# Altium project Graviton.PrjPcb (part 3 of 3)

## Sheet adc-power.SchDoc: ADC - Power
size Letter; CheckedBy: J. Brinton; CompanyName: Signal Laboratories, Inc.; DrawnBy: J. Brinton; Engineer: J. Brinton; Address1: 3479 Edison Way; Address2: Menlo Park CA 94025; Address3: +1 (877) 778-8435; Address4: siglabs.com; Revision: 3; SheetNumber: 22; SheetTotal: 49
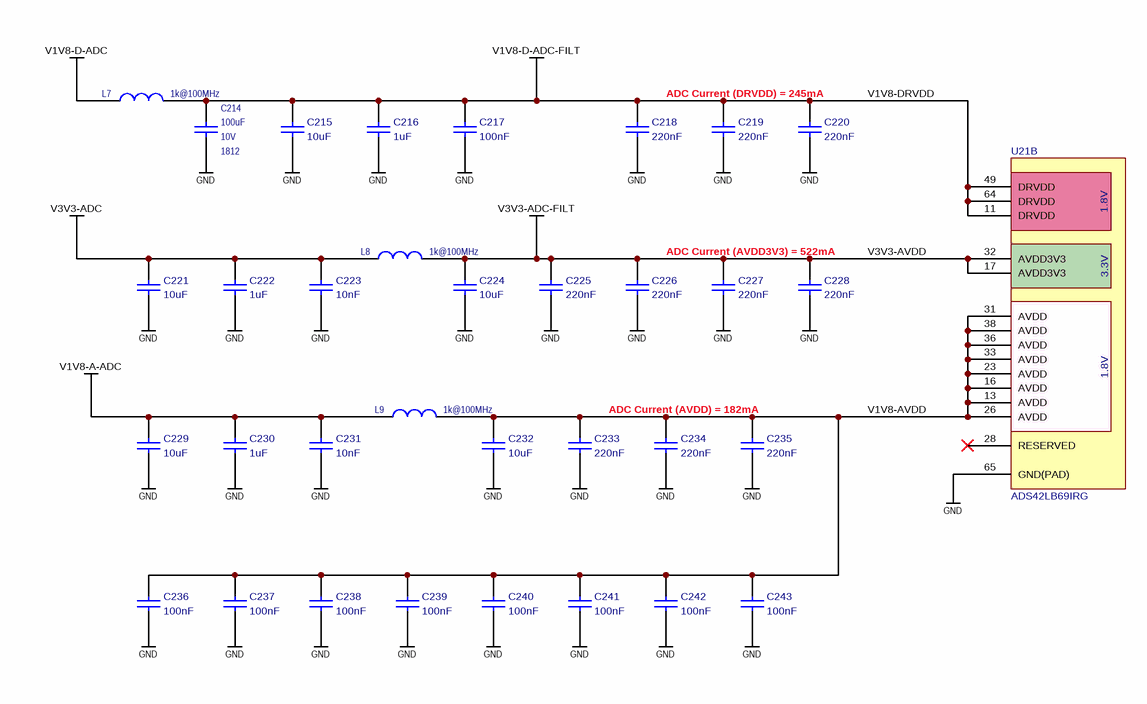
[diagram p16: adc-power.SchDoc]

### Parts
C214  value 100uF  Voltage: 10V  Package: 1812  [CAPC450X320X360L20N]  (hidden comment: C4532X5R1A107M280KC)
C215  value 10uF  [CAPC200X125X145L45N]  (hidden comment: CL21B106KOQNNNE)
C216  value 1uF  [CAPC200X125X145L45N]  (hidden comment: TMK212B7105KG)
C217  value 100nF  [CAPC100X50X55L25N]  (hidden comment: CC0402KRX7R8BB104)
C218  value 220nF  [CAPC100X50X55L25N]  (hidden comment: C1005X7R1E224K050BE)
C219  value 220nF  [CAPC100X50X55L25N]  (hidden comment: C1005X7R1E224K050BE)
C220  value 220nF  [CAPC100X50X55L25N]  (hidden comment: C1005X7R1E224K050BE)
C221  value 10uF  [CAPC200X125X145L45N]  (hidden comment: CL21B106KOQNNNE)
C222  value 1uF  [CAPC200X125X145L45N]  (hidden comment: TMK212B7105KG)
C223  value 10nF  [CAPC100X50X55L25N]  (hidden comment: GRM155R71H103KA88)
C224  value 10uF  [CAPC200X125X145L45N]  (hidden comment: CL21B106KOQNNNE)
C225  value 220nF  [CAPC100X50X55L25N]  (hidden comment: C1005X7R1E224K050BE)
C226  value 220nF  [CAPC100X50X55L25N]  (hidden comment: C1005X7R1E224K050BE)
C227  value 220nF  [CAPC100X50X55L25N]  (hidden comment: C1005X7R1E224K050BE)
C228  value 220nF  [CAPC100X50X55L25N]  (hidden comment: C1005X7R1E224K050BE)
C229  value 10uF  [CAPC200X125X145L45N]  (hidden comment: CL21B106KOQNNNE)
C230  value 1uF  [CAPC200X125X145L45N]  (hidden comment: TMK212B7105KG)
C231  value 10nF  [CAPC100X50X55L25N]  (hidden comment: GRM155R71H103KA88)
C232  value 10uF  [CAPC200X125X145L45N]  (hidden comment: CL21B106KOQNNNE)
C233  value 220nF  [CAPC100X50X55L25N]  (hidden comment: C1005X7R1E224K050BE)
C234  value 220nF  [CAPC100X50X55L25N]  (hidden comment: C1005X7R1E224K050BE)
C235  value 220nF  [CAPC100X50X55L25N]  (hidden comment: C1005X7R1E224K050BE)
C236  value 100nF  [CAPC100X50X55L25N]  (hidden comment: CC0402KRX7R8BB104)
C237  value 100nF  [CAPC100X50X55L25N]  (hidden comment: CC0402KRX7R8BB104)
C238  value 100nF  [CAPC100X50X55L25N]  (hidden comment: CC0402KRX7R8BB104)
C239  value 100nF  [CAPC100X50X55L25N]  (hidden comment: CC0402KRX7R8BB104)
C240  value 100nF  [CAPC100X50X55L25N]  (hidden comment: CC0402KRX7R8BB104)
C241  value 100nF  [CAPC100X50X55L25N]  (hidden comment: CC0402KRX7R8BB104)
C242  value 100nF  [CAPC100X50X55L25N]  (hidden comment: CC0402KRX7R8BB104)
C243  value 100nF  [CAPC100X50X55L25N]  (hidden comment: CC0402KRX7R8BB104)
L7  value 1k@100MHz  [1806]  (hidden comment: BLM41PG102SN1L)
L8  value 1k@100MHz  [1806]  (hidden comment: BLM41PG102SN1L)
L9  value 1k@100MHz  [1806]  (hidden comment: BLM41PG102SN1L)
U21  ADS42LB69IRG  [S-PVQFN-N64]  (part B of 4)

### Nets
GND: C214.1 C215.2 C216.2 C217.2 C218.2 C219.2 C220.2 C221.2 C222.2 C223.2 C224.2 C225.2 C226.2 C227.2 C228.2 C229.2 C230.2 C231.2 C232.2 C233.2 C234.2 C235.2 C236.2 C237.2 C238.2 C239.2 C240.2 C241.2 C242.2 C243.2 U21.65(GND(PAD))
V1V8-A-ADC: C229.1 C230.1 C231.1 L9.1
V1V8-D-ADC: L7.1
V1V8-D-ADC-FILT: C214.2 C215.1 C216.1 C217.1 C218.1 C219.1 C220.1 L7.2 U21.11(DRVDD) U21.49(DRVDD) U21.64(DRVDD)  [also labelled V1V8-DRVDD]
V3V3-ADC: C221.1 C222.1 C223.1 L8.1
V3V3-ADC-FILT: C224.1 C225.1 C226.1 C227.1 C228.1 L8.2 U21.17(AVDD3V3) U21.32(AVDD3V3)  [also labelled V3V3-AVDD]
V1V8-AVDD: C232.1 C233.1 C234.1 C235.1 C236.1 C237.1 C238.1 C239.1 C240.1 C241.1 C242.1 C243.1 L9.2 U21.13(AVDD) U21.16(AVDD) U21.23(AVDD) U21.26(AVDD) U21.31(AVDD) U21.33(AVDD) U21.36(AVDD) U21.38(AVDD)  [project net V1V8-AVDD_22]

Not connected (* = marked no-connect by the designer): U21 28(RESERVED)*

### Notes on the sheet
- ADC Current (DRVDD) = 245mA
- ADC Current (AVDD3V3) = 522mA
- ADC Current (AVDD) = 182mA
- Title
- Engineer
- Revision
- Drawn By
- Checked By
- Date
- Sheet
- of
- (in symbol ADS42LB69IRG, part B) 1.8V; 3.3V

### Library data of the parts
C214 = CAP 0603: Ceramic Capacitor 100uF ±20% 10V X5R 1812; Manufacturer: TDK; Tr: -55:85; Manufacturer P/N: C4532X5R1A107M280KC; Tolerance: ±20%
C215 C221 C224 C229 C232 = LMK212B7106KG: Ceramic Capacitor 10uF ±10% 16V X7R 0805; Manufacturer: Samsung; Tr: -55:105; Manufacturer P/N: CL21B106KOQNNNE; Tolerance: ±10%; Package: 0805; Voltage: 16V
C216 C222 C230 = TMK212B7105KG: Ceramic Capacitor 1uF ±10% 25V X7R 0805; Manufacturer: Taiyo Yuden; Manufacturer P/N: TMK212B7105KG; Tolerance: ±10%; Tr: *; Package: 0805; Voltage: 25V
C217 C236-C243 = TMK105B7104KV: Ceramic Capacitor 100nF ±10% 25V X7R 0402; Manufacturer: Yageo; Tolerance: ±10%; Tr: *; Package: 0402; Voltage: 25V
  C217: Manufacturer P/N: CC0402KRX7R8BB104
  C236-C243: Manufacturer P/N: TMK105B7104KV
C218-C220 C225-C228 C233-C235 = TMK105B7224KV: Ceramic Capacitor 220nF ±10% 25V X7R 0402; Manufacturer: TDK; Manufacturer P/N: C1005X7R1E224K050BE; Tolerance: ±10%; Tr: *; Package: 0402; Voltage: 25V
C223 C231 = TMK105B7103KV: Ceramic Capacitor 10nF ±10% 50V X7R 0402; Manufacturer: Murata; Tr: -55:125; Manufacturer P/N: GRM155R71H103KA88; Tolerance: ±10%; Package: 0402
L7-L9 = INDUCTANCE1: Ferrite Bead 1k@100MHz 1.5A 1806; Manufacturer: Murata; Tr: -55:125; Manufacturer P/N: BLM41PG102SN1L; Package: 1806
U21 = ADS42LB69IRG: Dual-Channel, 16-Bit, 250-MSPS Analog-to-Digital Converter; Manufacturer: Texas Instruments; Manufacturer P/N: ADS42LB69IRG

## Sheet adc-analog.SchDoc: ADC - Analog
size Letter; CheckedBy: J. Brinton; CompanyName: Signal Laboratories, Inc.; DrawnBy: J. Brinton; Engineer: J. Brinton; Address1: 3479 Edison Way; Address2: Menlo Park CA 94025; Address3: +1 (877) 778-8435; Address4: siglabs.com; Revision: 3; SheetNumber: 21; SheetTotal: 49; ModifiedDate: 4/20/2018
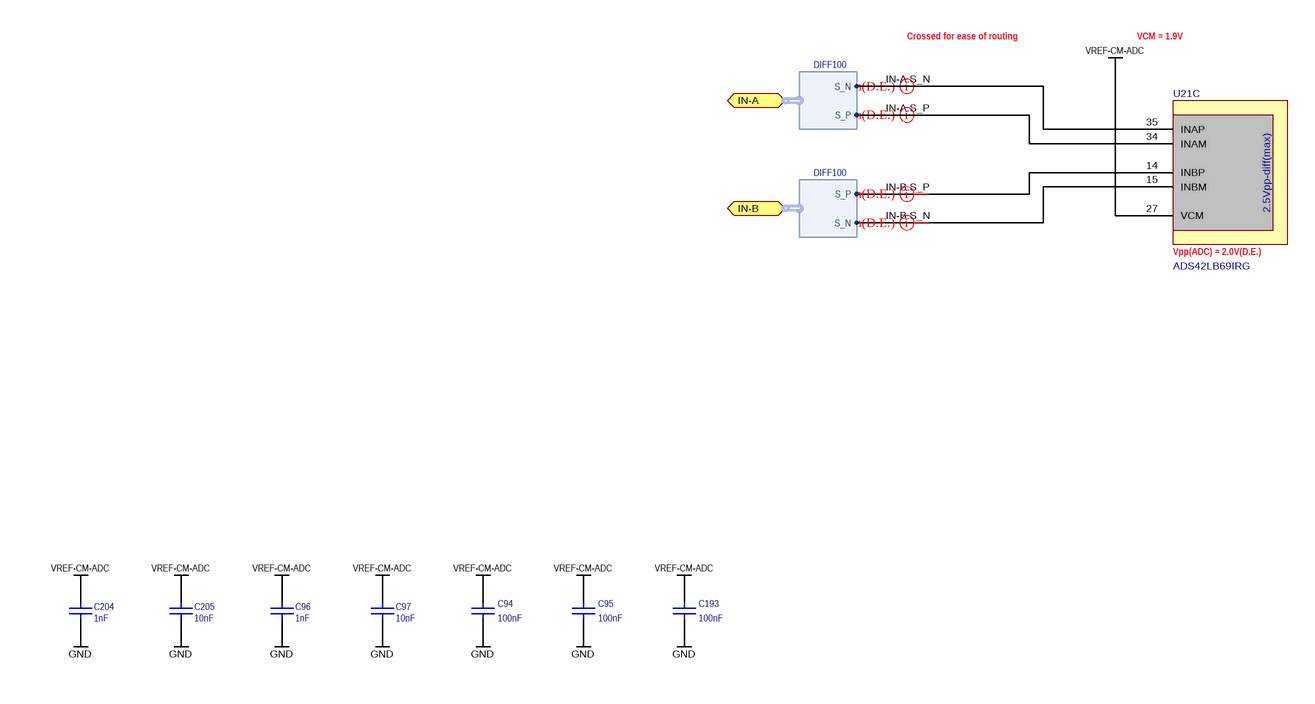
[diagram p17: adc-analog.SchDoc]

### Parts
C94  value 100nF  [CAPC100X50X55L25N]  (hidden comment: GRM155R71C104KA88J)
C95  value 100nF  [CAPC100X50X55L25N]  (hidden comment: GRM155R71C104KA88J)
C96  value 1nF  [CAPC100X50X55L25N]  (hidden comment: CGA2B2NP01H102J050BA)
C97  value 10nF  [CAPC100X50X55L25N]  (hidden comment: GRM155R71H103KA88)
C193  value 100nF  [CAPC100X50X55L25N]  (hidden comment: GRM155R71C104KA88J)
C204  value 1nF  [CAPC100X50X55L25N]  (hidden comment: CGA2B2NP01H102J050BA)
C205  value 10nF  [CAPC100X50X55L25N]  (hidden comment: GRM155R71H103KA88)
U21  ADS42LB69IRG  [S-PVQFN-N64]  (part C of 4)

### Ports
IN-A (harness DIFF100), IN-B (harness DIFF100)

### Harnesses
DIFF100: S_P, S_N

### Nets
GND: C94.2 C95.2 C96.1 C97.1 C193.2 C204.1 C205.1
VREF-CM-ADC: C94.1 C95.1 C96.2 C97.2 C193.1 C204.2 C205.2 U21.27(VCM)
IN-A.S_N: U21.35(INAP) ; port IN-A.S_N
IN-A.S_P: U21.34(INAM) ; port IN-A.S_P
IN-B.S_N: U21.15(INBM) ; port IN-B.S_N
IN-B.S_P: U21.14(INBP) ; port IN-B.S_P

### Layout directives
differential pair; net class z100diff12; Name: 100-Ohm(D.E.): IN-A.S_N, IN-A.S_P, IN-B.S_N, IN-B.S_P

### Notes on the sheet
- Crossed for ease of routing
- VCM = 1.9V
- (near U21) Vpp(ADC) = 2.0V(D.E.)
- Title
- Engineer
- Revision
- Drawn By
- Checked By
- Date
- Sheet
- of
- (in symbol ADS42LB69IRG, part C) 2.5Vpp-diff(max)

### Library data of the parts
C94 C95 C193 = CAP 0402: as C102 on sheet dac-analog; Voltage: 16V; Manufacturer P/N: GRM155R71C104KA88J; Package: 0402; Tolerance: ±10%
C96 C204 = CAP 0402: as C86 on sheet dac-digital; Voltage: 50V; Manufacturer P/N: CGA2B2NP01H102J050BA; Package: 0402; Tolerance: ±5%
C97 C205 = CAP 0402: as C290 on sheet dac-power; Voltage: 50V; Manufacturer P/N: GRM155R71H103KA88; Package: 0402; Tolerance: ±10%
U21 = ADS42LB69IRG: as U21 on sheet adc-power; Manufacturer P/N: ADS42LB69IRG

## Sheet adc-ldo.SchDoc: ADC - LDOs
size Letter; CheckedBy: J. Brinton; CompanyName: Signal Laboratories, Inc.; DrawnBy: J. Brinton; Engineer: J. Brinton; Address1: 3479 Edison Way; Address2: Menlo Park CA 94025; Address3: +1 (877) 778-8435; Address4: siglabs.com; Revision: 3; SheetNumber: 23; SheetTotal: 49
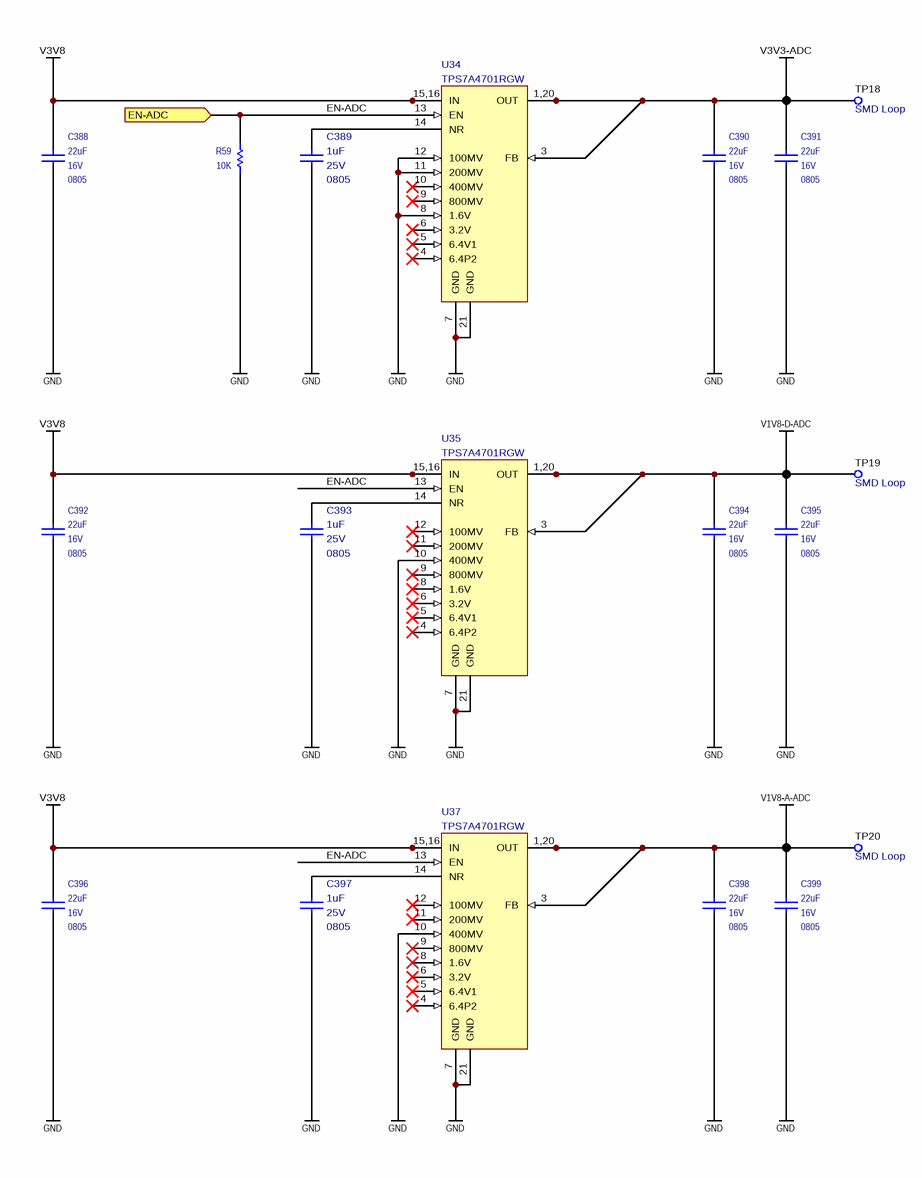
[diagram p18: adc-ldo.SchDoc]

### Parts
C388  value 22uF  Voltage: 16V  Package: 0805  [CAPC200X125X145L45N]  (hidden comment: CL21A226KOQNNNE)
C389  value 1uF  Package: 0805  Voltage: 25V  [CAPC200X125X145L45N]  (hidden comment: TMK212B7105KG)
C390  value 22uF  Voltage: 16V  Package: 0805  [CAPC200X125X145L45N]  (hidden comment: CL21A226KOQNNNE)
C391  value 22uF  Voltage: 16V  Package: 0805  [CAPC200X125X145L45N]  (hidden comment: CL21A226KOQNNNE)
C392  value 22uF  Voltage: 16V  Package: 0805  [CAPC200X125X145L45N]  (hidden comment: CL21A226KOQNNNE)
C393  value 1uF  Package: 0805  Voltage: 25V  [CAPC200X125X145L45N]  (hidden comment: TMK212B7105KG)
C394  value 22uF  Voltage: 16V  Package: 0805  [CAPC200X125X145L45N]  (hidden comment: CL21A226KOQNNNE)
C395  value 22uF  Voltage: 16V  Package: 0805  [CAPC200X125X145L45N]  (hidden comment: CL21A226KOQNNNE)
C396  value 22uF  Voltage: 16V  Package: 0805  [CAPC200X125X145L45N]  (hidden comment: CL21A226KOQNNNE)
C397  value 1uF  Package: 0805  Voltage: 25V  [CAPC200X125X145L45N]  (hidden comment: TMK212B7105KG)
C398  value 22uF  Voltage: 16V  Package: 0805  [CAPC200X125X145L45N]  (hidden comment: CL21A226KOQNNNE)
C399  value 22uF  Voltage: 16V  Package: 0805  [CAPC200X125X145L45N]  (hidden comment: CL21A226KOQNNNE)
R59  value 10K  [RESC1005X40N]  (hidden comment: ERJ-2RKF1002X)
TP18  Notes: SMD Loop  [5015]  (hidden comment: 5015)
TP19  Notes: SMD Loop  [5015]  (hidden comment: 5015)
TP20  Notes: SMD Loop  [5015]  (hidden comment: 5015)
U34  TPS7A4701RGW  [QFN65P500X500X100-21N]
U35  TPS7A4701RGW  [QFN65P500X500X100-21N]
U37  TPS7A4701RGW  [QFN65P500X500X100-21N]

### Ports
EN-ADC (in)

### Nets
GND: C388.1 C389.2 C390.1 C391.1 C392.1 C393.2 C394.1 C395.1 C396.1 C397.2 C398.1 C399.1 R59.2 U34.7(GND) U34.8(1.6V) U34.11(200MV) U34.12(100MV) U34.21(GND) U35.7(GND) U35.10(400MV) U35.21(GND) U37.7(GND) U37.10(400MV) U37.21(GND)
V1V8-A-ADC: C398.2 C399.2 TP20.1 U37.1(OUT) U37.3(FB) U37.20(OUT)
V1V8-D-ADC: C394.2 C395.2 TP19.1 U35.1(OUT) U35.3(FB) U35.20(OUT)
V3V3-ADC: C390.2 C391.2 TP18.1 U34.1(OUT) U34.3(FB) U34.20(OUT)
V3V8: C388.2 C392.2 C396.2 U34.15(IN) U34.16(IN) U35.15(IN) U35.16(IN) U37.15(IN) U37.16(IN)
EN-ADC: R59.1 U34.13(EN) U35.13(EN) U37.13(EN) ; port EN-ADC
NetC389_1: C389.1 U34.14(NR)
NetC393_1: C393.1 U35.14(NR)
NetC397_1: C397.1 U37.14(NR)

Not connected (* = marked no-connect by the designer): U34 4(6.4P2)* 5(6.4V1)* 6(3.2V)* 9(800MV)* 10(400MV)*; U35 4(6.4P2)* 5(6.4V1)* 6(3.2V)* 8(1.6V)* 9(800MV)* 11(200MV)* 12(100MV)*; U37 4(6.4P2)* 5(6.4V1)* 6(3.2V)* 8(1.6V)* 9(800MV)* 11(200MV)* 12(100MV)*

### Notes on the sheet
- Title
- Engineer
- Revision
- Drawn By
- Checked By
- Date
- Sheet
- of
- (in symbol TPS7A4701RGW_1) 15,16; 1,20

### Library data of the parts
C388 C390-C392 C394-C396 C398 C399 = CAP 0603: Ceramic Capacitor 22uF ±10% 16V X5R 0805; Manufacturer: Samsung; Tr: -55:85; Manufacturer P/N: CL21A226KOQNNNE; Tolerance: ±10%
C389 C393 C397 = TMK212B7105KG: as C216 on sheet adc-power; Manufacturer P/N: TMK212B7105KG; Tolerance: ±10%; Tr: *
R59 = RES 0402: as R62 on sheet dac-ldo; Package: 0402; Manufacturer P/N: ERJ-2RKF1002X; Tolerance: ±1%
TP18-TP20 = TEST_POINT_SMD_50: Test Point SMD; Manufacturer: Keystone; Manufacturer P/N: 5015
U34 U35 U37 = TPS7A4701RGW_1: Low-Dropout Linear Regulator 20-VQFN; Manufacturer: Texas Instruments; Manufacturer P/N: TPS7A4701RGW; Package: VQFN-20

## Sheet fans.SchDoc: Fan
size Letter; CheckedBy: J. Brinton; CompanyName: Signal Laboratories, Inc.; DrawnBy: J. Brinton; Engineer: J. Brinton; Address1: 3479 Edison Way; Address2: Menlo Park CA 94025; Address3: +1 (877) 778-8435; Address4: siglabs.com; Revision: 3; SheetNumber: 40; SheetTotal: 49
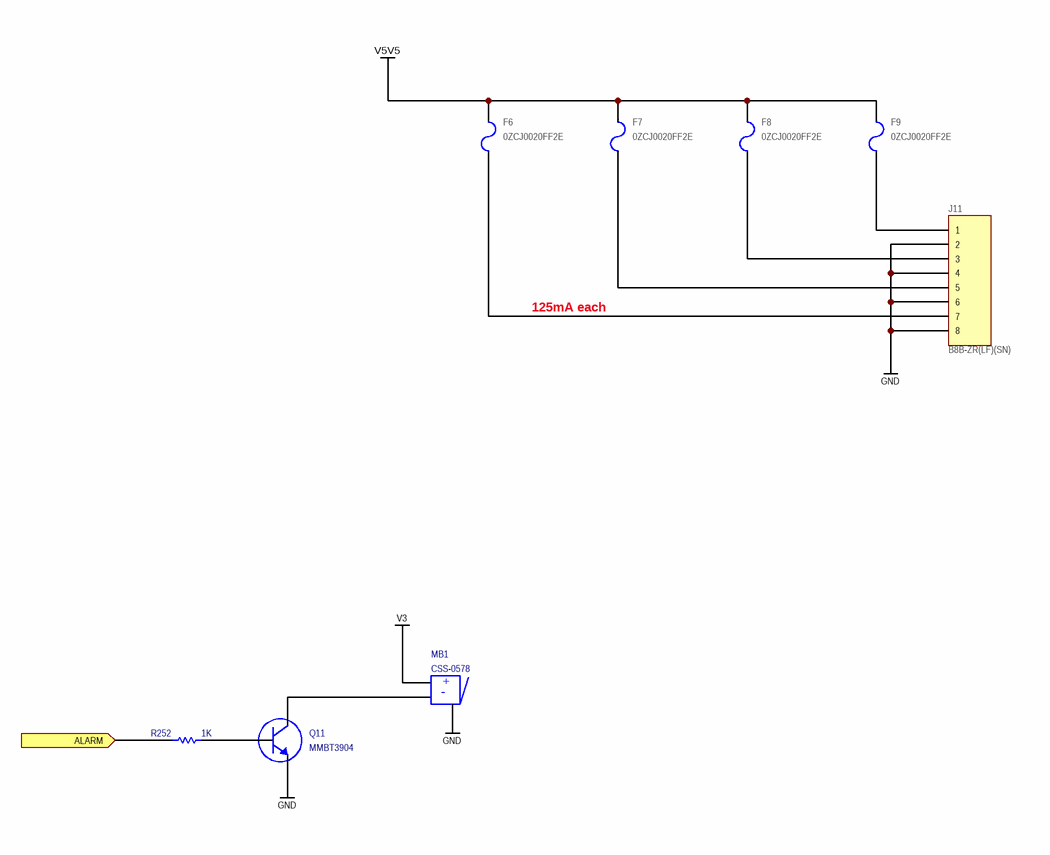
[diagram p19: fans.SchDoc]

### Parts
F6  0ZCJ0020FF2E  [1206]
F7  0ZCJ0020FF2E  [1206]
F8  0ZCJ0020FF2E  [1206]
F9  0ZCJ0020FF2E  [1206]
J11  B8B-ZR(LF)(SN)  [B8B-ZR]
MB1  CSS-0578  [CSS-0578]
Q11  MMBT3904  [SOT23]
R252  value 1K  [RESC1005X40N]  (hidden comment: RC0402FR-071KL)

### Ports
ALARM (in)

### Nets
GND: J11.2 J11.4 J11.6 J11.8 MB1.3(TAB) Q11.2(E)
V3: MB1.1(POS)
V5V5: F6.1 F7.1 F8.1 F9.1
NetF6_2: F6.2 J11.7
NetF7_2: F7.2 J11.5
NetF8_2: F8.2 J11.3
NetF9_2: F9.2 J11.1
NetMB1_2: MB1.2(NEG) Q11.3(C)
NetQ11_1: Q11.1(B) R252.1
NetR252_2: R252.2 ; port ALARM

### Notes on the sheet
- 125mA each
- Title
- Engineer
- Revision
- Drawn By
- Checked By
- Date
- Sheet
- of
- (in symbol CSS-0578) +; -

### Library data of the parts
F6-F9 = 0ZCJ0020FF2E: PTC Resettable Fuse, 0.2A, 30V, SMD 1206; Manufacturer: Bell Fuse; Manufacturer P/N: 0ZCJ0020FF2E; Package: 1206
J11 = Header 8: Through-hole Shrouded Header 8-Position; Manufacturer: JST; Manufacturer P/N: B8B-ZR(LF)(SN)
MB1 = CSS-0578: Magnetic Buzzer; Manufacturer: CUI, Inc.; Manufacturer P/N: CSS-0578
Q11 = 2N3904: NPN General Purpose Amplifier; Manufacturer: Fairchild Semiconductor; Manufacturer P/N: MMBT3904
R252 = RES 0402: Thick Film Resistor 1k ±1% 0402; Manufacturer: Yageo; Tr: -55:155; Package: 0402; Manufacturer P/N: RC0402FR-071KL; Tolerance: ±1%

## Sheet clock.SchDoc: Clock
size 431 x 241 mm; CheckedBy: J. Brinton; CompanyName: Signal Laboratories, Inc.; DrawnBy: J. Brinton; Engineer: J. Brinton; Address1: 3479 Edison Way; Address2: Menlo Park CA 94025; Address3: +1 (877) 778-8435; Address4: siglabs.com; Revision: 3; SheetNumber: 32; SheetTotal: 49
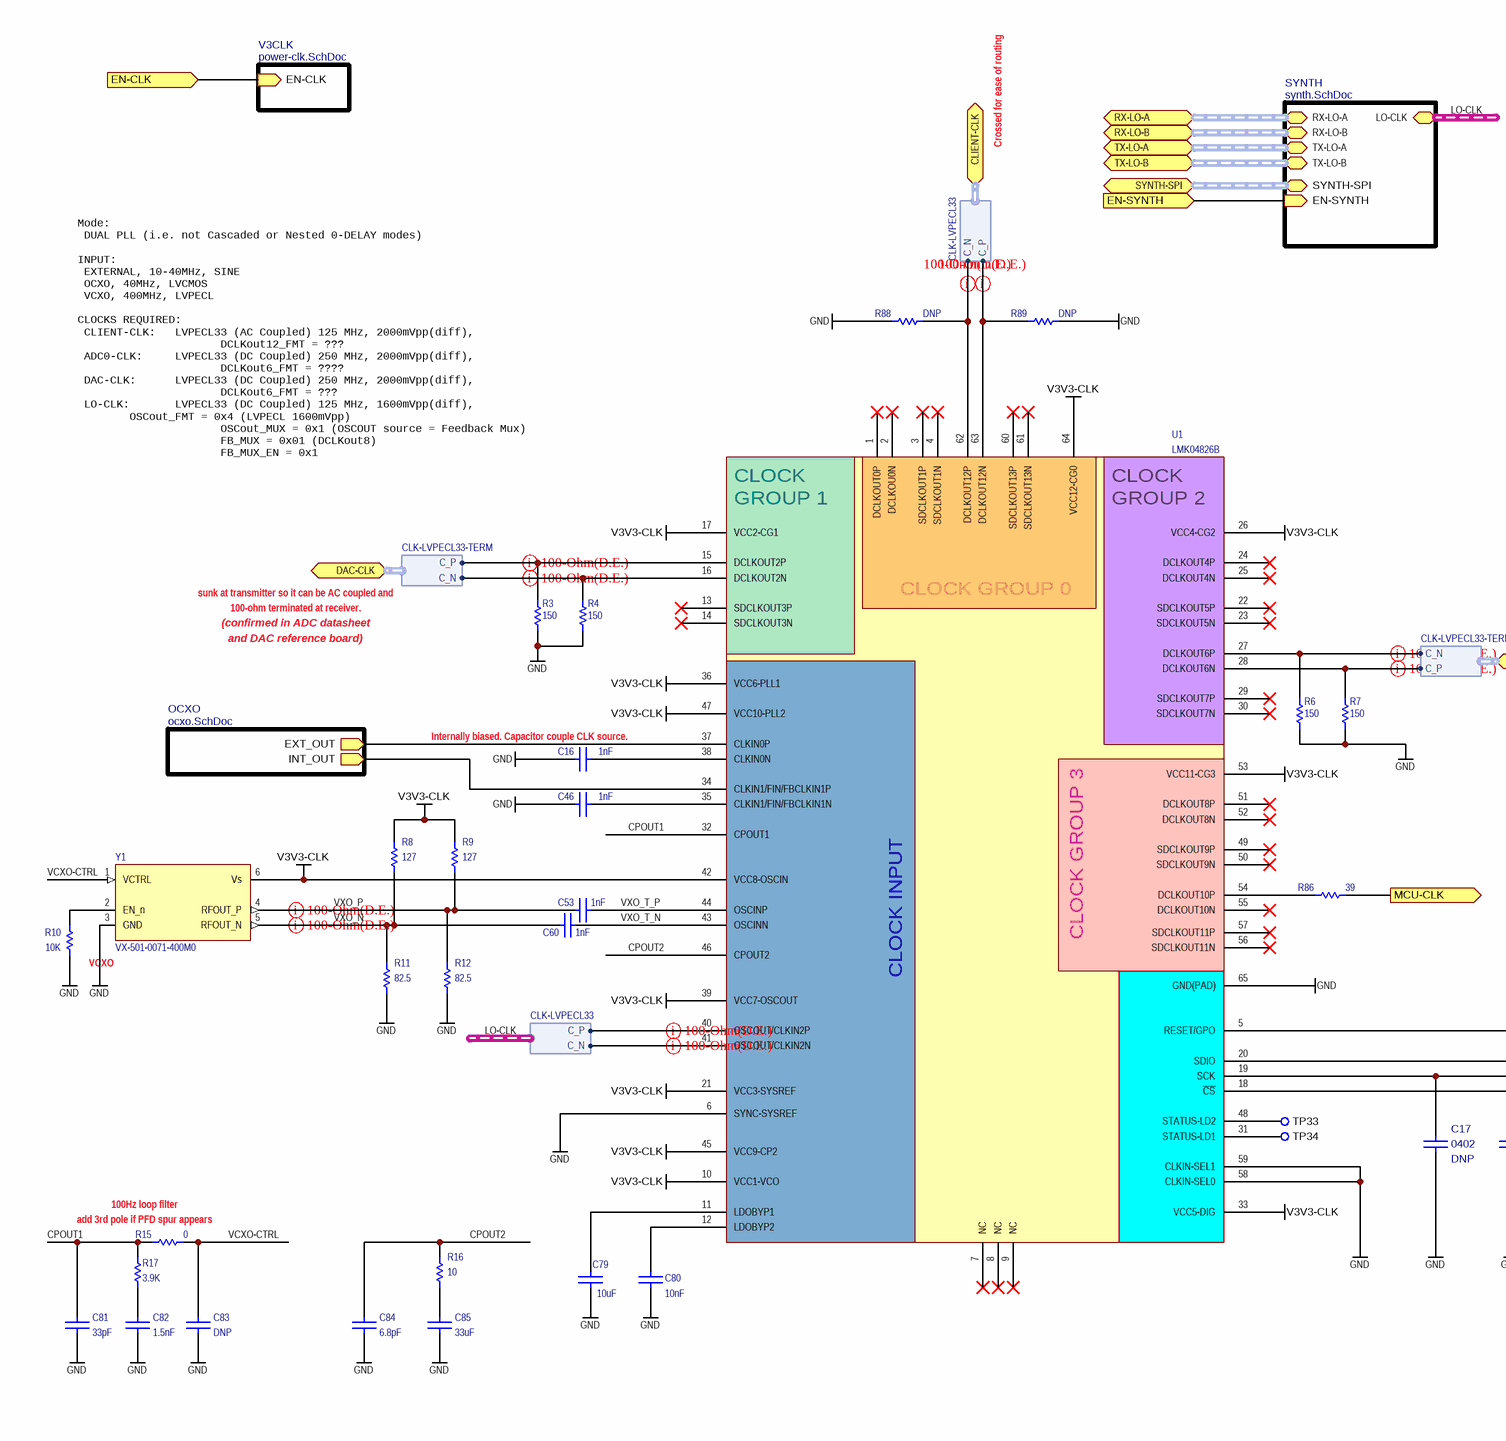
[diagram p20: clock.SchDoc, left]
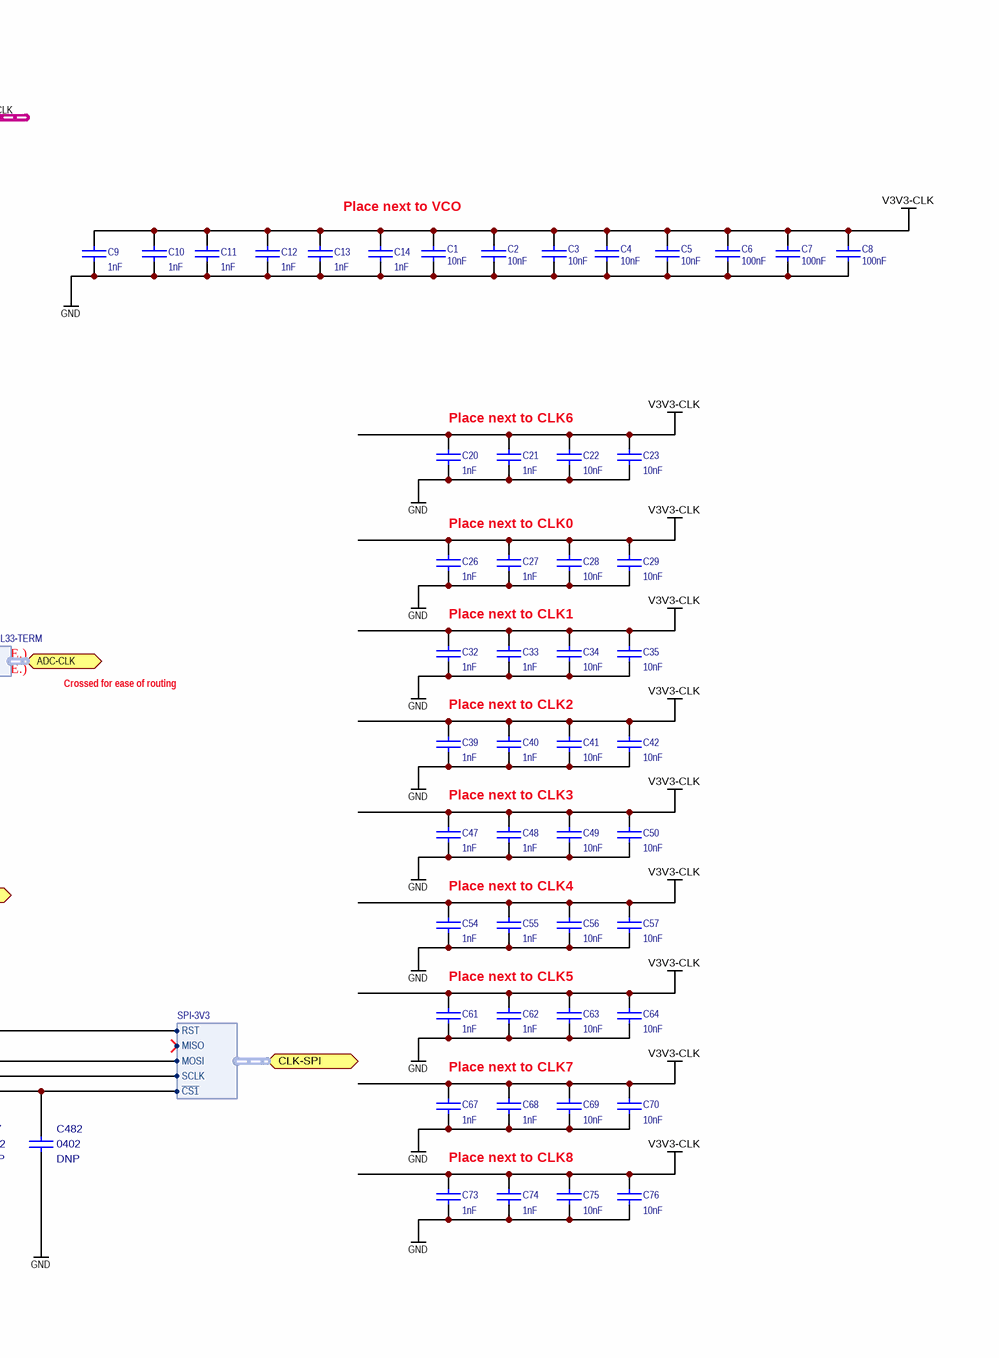
[diagram p21: clock.SchDoc, right]

### Parts
C1  value 10nF  [CAPC100X50X55L25N]  (hidden comment: GRM155R71H103KA88)
C2  value 10nF  [CAPC100X50X55L25N]  (hidden comment: GRM155R71H103KA88)
C3  value 10nF  [CAPC100X50X55L25N]  (hidden comment: GRM155R71H103KA88)
C4  value 10nF  [CAPC100X50X55L25N]  (hidden comment: GRM155R71H103KA88)
C5  value 10nF  [CAPC100X50X55L25N]  (hidden comment: GRM155R71H103KA88)
C6  value 100nF  [CAPC100X50X55L25N]  (hidden comment: GRM155R71C104KA88J)
C7  value 100nF  [CAPC100X50X55L25N]  (hidden comment: GRM155R71C104KA88J)
C8  value 100nF  [CAPC100X50X55L25N]  (hidden comment: GRM155R71C104KA88J)
C9  value 1nF  [CAPC100X50X55L25N]  (hidden comment: CGA2B2NP01H102J050BA)
C10  value 1nF  [CAPC100X50X55L25N]  (hidden comment: CGA2B2NP01H102J050BA)
C11  value 1nF  [CAPC100X50X55L25N]  (hidden comment: CGA2B2NP01H102J050BA)
C12  value 1nF  [CAPC100X50X55L25N]  (hidden comment: CGA2B2NP01H102J050BA)
C13  value 1nF  [CAPC100X50X55L25N]  (hidden comment: CGA2B2NP01H102J050BA)
C14  value 1nF  [CAPC100X50X55L25N]  (hidden comment: CGA2B2NP01H102J050BA)
C16  value 1nF  [CAPC100X50X55L25N]  (hidden comment: CGA2B2NP01H102J050BA)
C17  Package: 0402  Do Not Place: DNP  [CAPC100X50X55L25N]  (hidden comment: VJ0402A101KXA)
C20  value 1nF  [CAPC100X50X55L25N]  (hidden comment: CGA2B2NP01H102J050BA)
C21  value 1nF  [CAPC100X50X55L25N]  (hidden comment: CGA2B2NP01H102J050BA)
C22  value 10nF  [CAPC100X50X55L25N]  (hidden comment: GRM155R71H103KA88)
C23  value 10nF  [CAPC100X50X55L25N]  (hidden comment: GRM155R71H103KA88)
C26  value 1nF  [CAPC100X50X55L25N]  (hidden comment: CGA2B2NP01H102J050BA)
C27  value 1nF  [CAPC100X50X55L25N]  (hidden comment: CGA2B2NP01H102J050BA)
C28  value 10nF  [CAPC100X50X55L25N]  (hidden comment: GRM155R71H103KA88)
C29  value 10nF  [CAPC100X50X55L25N]  (hidden comment: GRM155R71H103KA88)
C32  value 1nF  [CAPC100X50X55L25N]  (hidden comment: CGA2B2NP01H102J050BA)
C33  value 1nF  [CAPC100X50X55L25N]  (hidden comment: CGA2B2NP01H102J050BA)
C34  value 10nF  [CAPC100X50X55L25N]  (hidden comment: GRM155R71H103KA88)
C35  value 10nF  [CAPC100X50X55L25N]  (hidden comment: GRM155R71H103KA88)
C39  value 1nF  [CAPC100X50X55L25N]  (hidden comment: CGA2B2NP01H102J050BA)
C40  value 1nF  [CAPC100X50X55L25N]  (hidden comment: CGA2B2NP01H102J050BA)
C41  value 10nF  [CAPC100X50X55L25N]  (hidden comment: GRM155R71H103KA88)
C42  value 10nF  [CAPC100X50X55L25N]  (hidden comment: GRM155R71H103KA88)
C46  value 1nF  [CAPC100X50X55L25N]  (hidden comment: CGA2B2NP01H102J050BA)
C47  value 1nF  [CAPC100X50X55L25N]  (hidden comment: CGA2B2NP01H102J050BA)
C48  value 1nF  [CAPC100X50X55L25N]  (hidden comment: CGA2B2NP01H102J050BA)
C49  value 10nF  [CAPC100X50X55L25N]  (hidden comment: GRM155R71H103KA88)
C50  value 10nF  [CAPC100X50X55L25N]  (hidden comment: GRM155R71H103KA88)
C53  value 1nF  [CAPC100X50X55L25N]  (hidden comment: CGA2B2NP01H102J050BA)
C54  value 1nF  [CAPC100X50X55L25N]  (hidden comment: CGA2B2NP01H102J050BA)
C55  value 1nF  [CAPC100X50X55L25N]  (hidden comment: CGA2B2NP01H102J050BA)
C56  value 10nF  [CAPC100X50X55L25N]  (hidden comment: GRM155R71H103KA88)
C57  value 10nF  [CAPC100X50X55L25N]  (hidden comment: GRM155R71H103KA88)
C60  value 1nF  [CAPC100X50X55L25N]  (hidden comment: CGA2B2NP01H102J050BA)
C61  value 1nF  [CAPC100X50X55L25N]  (hidden comment: CGA2B2NP01H102J050BA)
C62  value 1nF  [CAPC100X50X55L25N]  (hidden comment: CGA2B2NP01H102J050BA)
C63  value 10nF  [CAPC100X50X55L25N]  (hidden comment: GRM155R71H103KA88)
C64  value 10nF  [CAPC100X50X55L25N]  (hidden comment: GRM155R71H103KA88)
C67  value 1nF  [CAPC100X50X55L25N]  (hidden comment: CGA2B2NP01H102J050BA)
C68  value 1nF  [CAPC100X50X55L25N]  (hidden comment: CGA2B2NP01H102J050BA)
C69  value 10nF  [CAPC100X50X55L25N]  (hidden comment: GRM155R71H103KA88)
C70  value 10nF  [CAPC100X50X55L25N]  (hidden comment: GRM155R71H103KA88)
C73  value 1nF  [CAPC100X50X55L25N]  (hidden comment: CGA2B2NP01H102J050BA)
C74  value 1nF  [CAPC100X50X55L25N]  (hidden comment: CGA2B2NP01H102J050BA)
C75  value 10nF  [CAPC100X50X55L25N]  (hidden comment: GRM155R71H103KA88)
C76  value 10nF  [CAPC100X50X55L25N]  (hidden comment: GRM155R71H103KA88)
C79  value 10uF  [CAPC160X80X90L20N]  (hidden comment: ZRB18AR61E106ME01L)
C80  value 10nF  [CAPC100X50X55L25N]  (hidden comment: GRM155R71H103KA88)
C81  value 33pF  [CAPC100X50X55L25N]  (hidden comment: GRM1555C1H330JA01D)
C82  value 1.5nF  [CAPC100X50X55L25N]  (hidden comment: EMK105SD152KV-F)
C83  Do Not Place: DNP  [CAPC100X50X55L25N]  (hidden comment: CGA2B2NP01H102J050BA)
C84  value 6.8pF  [CAPC160X80X90L20N]  (hidden comment: 06032U6R8BAT2A)
C85  value 33uF  [CAPC2012X145N]  (hidden comment: C2012X5R1A336M125AC)
C482  Package: 0402  Do Not Place: DNP  [CAPC100X50X55L25N]  (hidden comment: VJ0402A101KXA)
R3  value 150  [RESC1005X40N]  (hidden comment: ERJ-2RKF1500X)
R4  value 150  [RESC1005X40N]  (hidden comment: ERJ-2RKF1500X)
R6  value 150  [RESC1005X40N]  (hidden comment: ERJ-2RKF1500X)
R7  value 150  [RESC1005X40N]  (hidden comment: ERJ-2RKF1500X)
R8  value 127  [RESC1005X40N]  (hidden comment: ERA-2AEB1270X)
R9  value 127  [RESC1005X40N]  (hidden comment: ERA-2AEB1270X)
R10  value 10K  [RESC1005X40N]  (hidden comment: ERJ-2RKF1002X)
R11  value 82.5  [RESC1005X40N]  (hidden comment: ERA-2AEB82R5X)
R12  value 82.5  [RESC1005X40N]  (hidden comment: ERA-2AEB82R5X)
R15  value 0  [RESC1005X40N]  (hidden comment: ERJ-2GE0R00X)
R16  value 10  [RESC1005X40N]  (hidden comment: MCS04020C1009FE000)
R17  value 3.9K  [RESC1608X55N]  (hidden comment: ERA-3AEB392V)
R86  value 39  [RESC1005X40N]  (hidden comment: RC0402FR-0739RL)
R88  Do Not Place: DNP  [RESC1005X40N]  (hidden comment: ERJ-2RKF1500X)
R89  Do Not Place: DNP  [RESC1005X40N]  (hidden comment: ERJ-2RKF1500X)
TP33  TEST_POINT_SMD_50  [TEST_POINT_SMD_10]  (value not drawn)  (no BOM)
TP34  TEST_POINT_SMD_50  [TEST_POINT_SMD_10]  (value not drawn)  (no BOM)
U1  LMK04826B  [NKD0064A]
Y1  VX-501-0071-400M0  [G218]

### Sub-sheets
OCXO = ocxo.SchDoc (file not in this document): EXT_OUT (out), INT_OUT (out)
SYNTH = synth.SchDoc (file not in this document): LO-CLK (harness CLK-LVPECL33), RX-LO-A (harness CLK-LVPECL33-TERM), RX-LO-B (harness CLK-LVPECL33-TERM), SYNTH-SPI (harness SPI-3V3), TX-LO-A (harness CLK-LVDS), TX-LO-B (harness CLK-LVDS), EN-SYNTH (in)
V3CLK = power-clk.SchDoc (file not in this document): EN-CLK (in)

### Ports
ADC-CLK (harness CLK-LVPECL33-TERM), CLIENT-CLK (harness CLK-LVPECL33), CLK-SPI (harness SPI-3V3), DAC-CLK (harness CLK-LVPECL33-TERM), EN-CLK (in), EN-SYNTH (in), MCU-CLK (out), RX-LO-A (harness CLK-LVPECL33-TERM), RX-LO-B (harness CLK-LVPECL33-TERM), SYNTH-SPI (harness SPI-3V3), TX-LO-A (harness CLK-LVDS), TX-LO-B (harness CLK-LVDS)

### Harnesses
CLK-LVPECL33: C_P, C_N
CLK-LVPECL33-TERM: C_P, C_N
SPI-3V3: MOSI, MISO, SCLK, ~{CS1}, RST

### Nets
GND: C1.1 C2.1 C3.1 C4.1 C5.1 C6.1 C7.1 C8.1 C9.1 C10.1 C11.1 C12.1 C13.1 C14.1 C16.2 C17.2 C20.1 C21.1 C22.1 C23.1 C26.1 C27.1 C28.1 C29.1 C32.1 C33.1 C34.1 C35.1 C39.1 C40.1 C41.1 C42.1 C46.2 C47.1 C48.1 C49.1 C50.1 C54.1 C55.1 C56.1 C57.1 C61.1 C62.1 C63.1 C64.1 C67.1 C68.1 C69.1 C70.1 C73.1 C74.1 C75.1 C76.1 C79.1 C80.1 C81.2 C82.2 C83.2 C84.2 C85.2 C482.2 R3.2 R4.2 R6.1 R7.1 R10.2 R11.1 R12.1 R88.2 R89.1 U1.6(SYNC-SYSREF) U1.58(CLKIN-SEL0) U1.59(CLKIN-SEL1) U1.65(GND(PAD)) Y1.3(GND)
V3V3-CLK: C1.2 C2.2 C3.2 C4.2 C5.2 C6.2 C7.2 C8.2 C9.2 C10.2 C11.2 C12.2 C13.2 C14.2 C20.2 C21.2 C22.2 C23.2 C26.2 C27.2 C28.2 C29.2 C32.2 C33.2 C34.2 C35.2 C39.2 C40.2 C41.2 C42.2 C47.2 C48.2 C49.2 C50.2 C54.2 C55.2 C56.2 C57.2 C61.2 C62.2 C63.2 C64.2 C67.2 C68.2 C69.2 C70.2 C73.2 C74.2 C75.2 C76.2 R8.2 R9.2 U1.10(VCC1-VCO) U1.17(VCC2-CG1) U1.21(VCC3-SYSREF) U1.26(VCC4-CG2) U1.33(VCC5-DIG) U1.36(VCC6-PLL1) U1.39(VCC7-OSCOUT) U1.42(VCC8-OSCIN) U1.45(VCC9-CP2) U1.47(VCC10-PLL2) U1.53(VCC11-CG3) U1.64(VCC12-CG0) Y1.6(Vs)
CPOUT1: C81.1 R15.1 R17.2 U1.32(CPOUT1)  [project net CPOUT1_32]
CPOUT2: C84.1 R16.2 U1.46(CPOUT2)  [project net CPOUT2_32]
LO-CLK.C_N: U1.41(OSCOUT/CLKIN2N) ; sheet SYNTH/LO-CLK.C_N
LO-CLK.C_P: U1.40(OSCOUT/CLKIN2P) ; sheet SYNTH/LO-CLK.C_P
VCXO-CTRL: C83.1 R15.2 Y1.1(VCTRL)  [project net VCXO-CTRL_32]
VXO_N: C60.1 R8.1 R11.2 Y1.5(RFOUT_N)  [project net VXO_N_32]
VXO_P: C53.2 R9.1 R12.2 Y1.4(RFOUT_P)  [project net VXO_P_32]
VXO_T_N: C60.2 U1.43(OSCINN)  [project net VXO_T_N_32]
VXO_T_P: C53.1 U1.44(OSCINP)  [project net VXO_T_P_32]
NetC16_1: C16.1 U1.38(CLKIN0N)
NetC17_1: C17.1 U1.19(SCK) ; port CLK-SPI.SCLK
NetC46_1: C46.1 U1.35(CLKIN1/FIN/FBCLKIN1N)
NetC79_2: C79.2 U1.11(LDOBYP1)
NetC80_2: C80.2 U1.12(LDOBYP2)
NetC82_1: C82.1 R17.1
NetC85_1: C85.1 R16.1
NetC482_1: C482.1 U1.18(~{CS}) ; port CLK-SPI.~{CS1}
NetR3_1: R3.1 U1.15(DCLKOUT2P) ; port DAC-CLK.C_P
NetR4_1: R4.1 U1.16(DCLKOUT2N) ; port DAC-CLK.C_N
NetR6_2: R6.2 U1.27(DCLKOUT6P) ; port ADC-CLK.C_N
NetR7_2: R7.2 U1.28(DCLKOUT6N) ; port ADC-CLK.C_P
NetR10_1: R10.1 Y1.2(EN_n)
NetR86_1: R86.1 U1.54(DCLKOUT10P)
NetR86_2: R86.2 ; port MCU-CLK
NetR88_1: R88.1 U1.62(DCLKOUT12P) ; port CLIENT-CLK.C_N
NetR89_2: R89.2 U1.63(DCLKOUT12N) ; port CLIENT-CLK.C_P
NetTP33_1: TP33.1 U1.48(STATUS-LD2)
NetTP34_1: TP34.1 U1.31(STATUS-LD1)
NetU1_5: U1.5(RESET/GPO) ; port CLK-SPI.RST
NetU1_20: U1.20(SDIO) ; port CLK-SPI.MOSI
NetU1_34: U1.34(CLKIN1/FIN/FBCLKIN1P) ; sheet OCXO/INT_OUT
NetU1_37: U1.37(CLKIN0P) ; sheet OCXO/EXT_OUT
(unnamed): port EN-CLK, sheet V3CLK/EN-CLK
(unnamed): port EN-SYNTH, sheet SYNTH/EN-SYNTH

Not connected (* = marked no-connect by the designer): U1 1(DCLKOUT0P)* 2(DCLKOU0N)* 3(SDCLKOUT1P)* 4(SDCLKOUT1N)* 7(NC)* 8(NC)* 9(NC)* 13(SDCLKOUT3P)* 14(SDCLKOUT3N)* 22(SDCLKOUT5P)* 23(SDCLKOUT5N)* 24(DCLKOUT4P)* 25(DCLKOUT4N)* 29(SDCLKOUT7P)* 30(SDCLKOUT7N)* 49(SDCLKOUT9P)* 50(SDCLKOUT9N)* 51(DCLKOUT8P)* 52(DCLKOUT8N)* 55(DCLKOUT10N)* 56(SDCLKOUT11N)* 57(SDCLKOUT11P)* 60(SDCLKOUT13P)* 61(SDCLKOUT13N)*

### Buses and harness runs
harness LO-CLK = sheet SYNTH/LO-CLK
harness port RX-LO-A = sheet SYNTH/RX-LO-A
harness port RX-LO-B = sheet SYNTH/RX-LO-B
harness port SYNTH-SPI = sheet SYNTH/SYNTH-SPI
harness port TX-LO-A = sheet SYNTH/TX-LO-A
harness port TX-LO-B = sheet SYNTH/TX-LO-B

### Layout directives
differential pair; net class z100diff12; Name: 100-Ohm(D.E.): LO-CLK.C_N, LO-CLK.C_P, NetR3_1, NetR4_1, NetR6_2, NetR7_2, NetR88_1, NetR89_2, VXO_N_32, VXO_P_32

### Notes on the sheet
- (near R89) Crossed for ease of routing
- Place next to VCO
- Place next to CLK6
- Mode:
  DUAL PLL (i.e. not Cascaded or Nested 0-DELAY modes)
  INPUT:
  EXTERNAL, 10-40MHz, SINE
  OCXO, 40MHz, LVCMOS
  VCXO, 400MHz, LVPECL
  CLOCKS REQUIRED:
  CLIENT-CLK:   LVPECL33 (AC Coupled) 125 MHz, 2000mVpp(diff),
  DCLKout12_FMT = ???
  ADC0-CLK:     LVPECL33 (DC Coupled) 250 MHz, 2000mVpp(diff),
  DCLKout6_FMT = ????
  DAC-CLK:      LVPECL33 (DC Coupled) 250 MHz, 2000mVpp(diff),
  DCLKout6_FMT = ???
  LO-CLK:       LVPECL33 (DC Coupled) 125 MHz, 1600mVpp(diff),
  OSCout_FMT = 0x4 (LVPECL 1600mVpp)
  OSCout_MUX = 0x1 (OSCOUT source = Feedback Mux)
  FB_MUX = 0x01 (DCLKout8)
  FB_MUX_EN = 0x1
- Place next to CLK0
- sunk at transmitter so it can be AC coupled and
- 100-ohm terminated at receiver.
- Place next to CLK1
- (confirmed in ADC datasheet
- and DAC reference board)
- (near R7) Crossed for ease of routing
- (near C16) Internally biased. Capacitor couple CLK source.
- Place next to CLK2
- Place next to CLK3
- Place next to CLK4
- VCXO
- Place next to CLK5
- Place next to CLK7
- 100Hz loop filter
- (near R15) add 3rd pole if PFD spur appears
- Place next to CLK8
- Title
- Engineer
- Revision
- Drawn By
- Checked By
- Date
- Sheet
- of
- (in symbol LMK04828) CLOCK; GROUP 1; GROUP 2; CLOCK GROUP 0; CLOCK GROUP 3; CLOCK INPUT

### Library data of the parts
C1-C5 C22 C23 C28 C29 C34 C35 C41 C42 C49 C50 C56 C57 C63 C64 C69 C70 C75 C76 C80 = CAP 0402: Ceramic Capacitor 10nF ±10% 50V X7R 0402; Manufacturer: Murata; Tr: -55:125; Voltage: 50V; Manufacturer P/N: GRM155R71H103KA88; Package: 0402; Tolerance: ±10%
C6-C8 = CAP 0402: Ceramic Capacitor 100nF ±10% 16V X7R 0402; Manufacturer: Murata; Tr: -55:125; Voltage: 16V; Manufacturer P/N: GRM155R71C104KA88J; Package: 0402; Tolerance: ±10%
C9-C14 C16 C20 C21 C26 C27 C32 C33 C39 C40 C46-C48 C53-C55 C60-C62 C67 C68 C73 C74 C83 = CAP 0402: Ceramic Capacitor 1nF ±5% 50V NP0 0402; Manufacturer: TDK; Tr: -55:150; Voltage: 50V; Manufacturer P/N: CGA2B2NP01H102J050BA; Package: 0402; Tolerance: ±5%
  C83: Value: 1nF
C17 C482 = VJ0402A101JXA: Ceramic Capacitor 100pF ±10% 50V C0G 0402; Manufacturer: Vishay; Tr: -55:150; Manufacturer P/N: VJ0402A101KXA; Tolerance: ±10%; Value: 100pF; Voltage: 50V
C79 = CAP: Ceramic Capacitor 10uF ±20% 25V X5R 0603; Manufacturer: Murata; Tr: -55:85; Manufacturer P/N: ZRB18AR61E106ME01L; Tolerance: ±20%; Voltage: 25V; Footprint: *; Package: 0603
C81 = CAP 0402: Ceramic Capacitor 33pF ±5% 50V NP0 0402; Manufacturer: Murata; Tr: -55:125; Voltage: 50V; Manufacturer P/N: GRM1555C1H330JA01D; Package: 0402; Tolerance: ±5%
C82 = CAP 0402: Ceramic Capacitor 1.5nF ±10% 16V RF 0402; Manufacturer: Taiyo Yuden; Tr: -55:125; Voltage: 16V; Manufacturer P/N: EMK105SD152KV-F; Package: 0402; Tolerance: ±10%
C84 = CAP 0402: Ceramic Capacitor 6.8pF ±0.1pF NP0 0603; Manufacturer: AVX; Voltage: 200V; Tr: -55"125; Manufacturer P/N: 06032U6R8BAT2A; Package: 0603; Tolerance: ±0.1pF
C85 = CAP 0402: Ceramic Capacitor 33uF ±20% 10V X5R 0805; Manufacturer: TDK; Tr: -55:85; Voltage: 10V; Manufacturer P/N: C2012X5R1A336M125AC; Package: 0805; Tolerance: ±20%
R3 R4 R6 R7 = RES 0402: Thick Film 150 ±1% 0402; Manufacturer: Panasonic; Tr: -55:155; Package: 0402; Manufacturer P/N: ERJ-2RKF1500X; Do Not Place: *; Tolerance: ±1%
R8 R9 = RES 0402: Thin Film Resistor 127 ±0.1% 0402; Manufacturer: Panasonic; Tr: -55:155; Package: 0402; Manufacturer P/N: ERA-2AEB1270X; Do Not Place: *; Tolerance: ±0.1%
R10 = RES 0402: Thick Film Resistor 10k ±1% 0.1W 50V 0402; Manufacturer: Panasonic; Tr: -55:155; Package: 0402; Manufacturer P/N: ERJ-2RKF1002X; Tolerance: ±1%
R11 R12 = RES 0402: Thin Film Resistor 82.5 ±0.1% 0402; Manufacturer: Panasonic; Tr: -55:155; Package: 0402; Manufacturer P/N: ERA-2AEB82R5X; Do Not Place: *; Tolerance: ±0.1%
R15 = RES 0603: Thick Film Resistor Jumper 0402; Manufacturer: Panasonic; Tr: -55:155; Package: 0402; Manufacturer P/N: ERJ-2GE0R00X
R16 = RES 0402: Thin Film Resistor 10 Ohm ±1% 0402; Manufacturer: Vishay; Tr: -55:155; Package: 0402; Manufacturer P/N: MCS04020C1009FE000; Do Not Place: *; Tolerance: ±1%
R17 = RES 0603: Thin Film Resistor 3.9k ±0.1% 0603; Manufacturer: Panasonic; Tr: -55:155; Package: 0603; Manufacturer P/N: ERA-3AEB392V; Tolerance: ±0.1%
R86 = RES 0402: Thick Film Resistor 39 ±1% 0402; Manufacturer: Yageo; Tr: -55:155; Package: 0402; Manufacturer P/N: RC0402FR-0739RL; Do Not Place: *; Tolerance: ±1%
R88 R89 = RES 0402: Thick Film 150 ±1% 0402; Manufacturer: Panasonic; Value: 150; Tr: -55:155; Package: 0402; Manufacturer P/N: ERJ-2RKF1500X; Tolerance: ±1%
TP33 TP34 = TEST_POINT_SMD_50: Test Point SMD
U1 = LMK04828: Low-Noise Clock Jitter Cleaner with Dual Loop PLLs; Manufacturer: Texas Instruments; Manufacturer P/N: LMK04826B
Y1 = VX-501: VCXO, Ultra Low Phase Noise, 490MHz; Manufacturer: Vectron; Manufacturer P/N: VX-501-0071-400M0; Do Not Place: *

## Sheet ingress.SchDoc: Power Ingress
size Letter; CheckedBy: J. Brinton; CompanyName: Signal Laboratories, Inc.; DrawnBy: J. Brinton; Engineer: J. Brinton; Address1: 3479 Edison Way; Address2: Menlo Park CA 94025; Address3: +1 (877) 778-8435; Address4: siglabs.com; Revision: 3; SheetNumber: 46; SheetTotal: 49
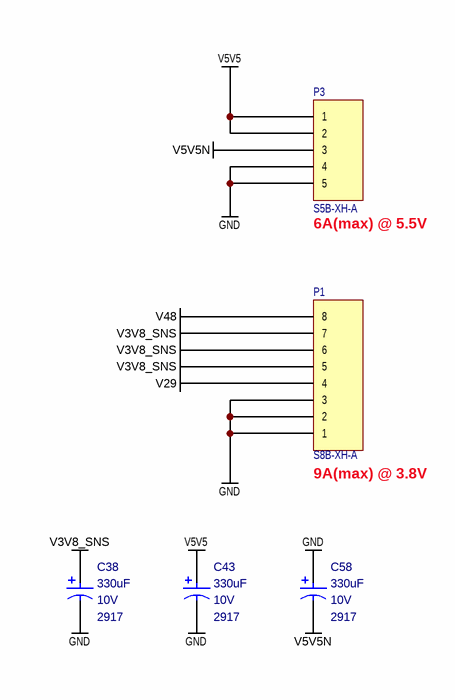
[diagram p22: ingress.SchDoc]

### Parts
C38  value 330uF  Package: 2917  Voltage: 10V  [CAPPM730X435X310L135X240N]  (hidden comment: TPSE337K010R0050)
C43  value 330uF  Package: 2917  Voltage: 10V  [CAPPM730X435X310L135X240N]  (hidden comment: TPSE337K010R0050)
C58  value 330uF  Package: 2917  Voltage: 10V  [CAPPM730X435X310L135X240N]  (hidden comment: TPSE337K010R0050)
P1  S8B-XH-A  [S8B-XH-A]
P3  S5B-XH-A  [S5B-XH-A]

### Nets
GND: C38.2 C43.2 C58.1 P1.1 P1.2 P1.3 P3.4 P3.5
V3V8_SNS: C38.1 P1.5 P1.6 P1.7
V5V5: C43.1 P3.1 P3.2
V5V5N: C58.2 P3.3
V29: P1.4
V48: P1.8

### Notes on the sheet
- (near P3) 6A(max) @ 5.5V
- (near P1) 9A(max) @ 3.8V
- Title
- Engineer
- Revision
- Drawn By
- Checked By
- Date
- Sheet
- of

### Library data of the parts
C38 C43 C58 = CAP_POL: Tantalum Capacitor 330uF ±10% 10V 2917; Manufacturer: AVX; Tr: -55:125; Manufacturer P/N: TPSE337K010R0050; Tolerance: ±10%
P1 = S8B-XH-A: 2.5mm pitch right angle 8-position; Manufacturer: JST; Manufacturer P/N: S8B-XH-A
P3 = S5B-XH-A: 2.5mm pitch right angle 5-position; Manufacturer: JST; Manufacturer P/N: S5B-XH-A

## Sheet adc-amp.SchDoc: ADC - Analog
size Letter; CheckedBy: J. Brinton; CompanyName: Signal Laboratories, Inc.; DrawnBy: J. Brinton; Engineer: J. Brinton; Address1: 3479 Edison Way; Address2: Menlo Park CA 94025; Address3: +1 (877) 778-8435; Address4: siglabs.com; Revision: 3; SheetNumber: 20; SheetTotal: 49; ModifiedDate: 4/20/2018
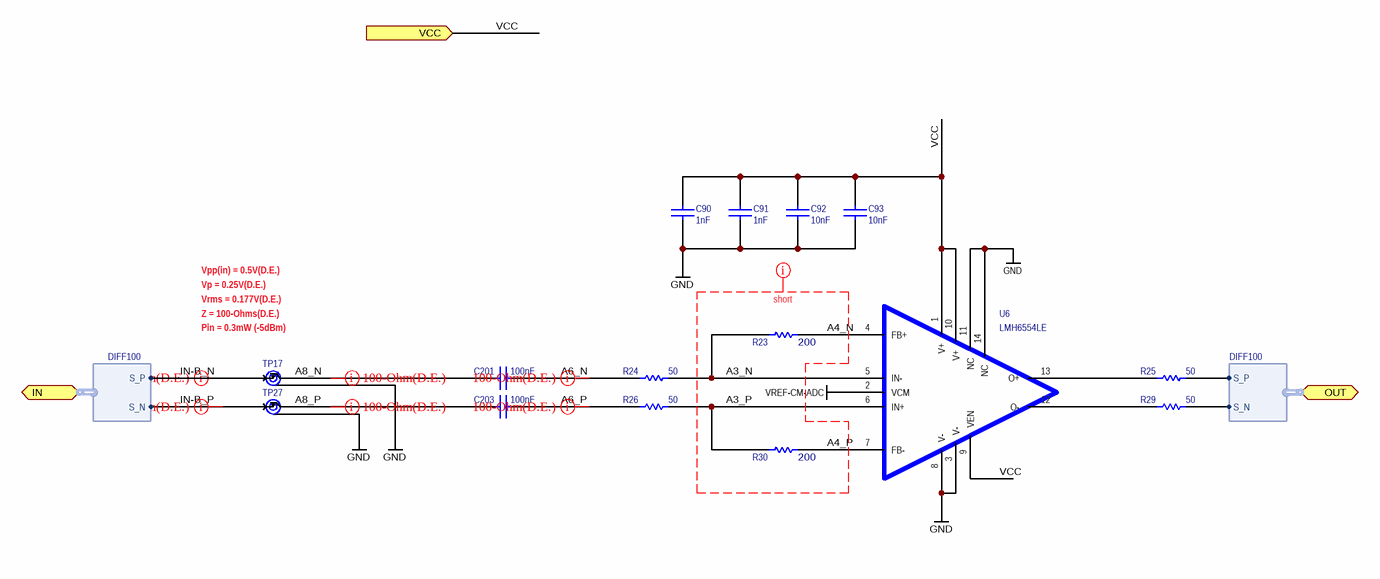
[diagram p23: adc-amp.SchDoc]

### Parts
C90  value 1nF  [CAPC100X50X55L25N]  (hidden comment: CGA2B2NP01H102J050BA)
C91  value 1nF  [CAPC100X50X55L25N]  (hidden comment: CGA2B2NP01H102J050BA)
C92  value 10nF  [CAPC100X50X55L25N]  (hidden comment: GRM155R71H103KA88)
C93  value 10nF  [CAPC100X50X55L25N]  (hidden comment: GRM155R71H103KA88)
C201  value 100nF  [CAPC100X50X55L25N]  (hidden comment: GRM155R71C104KA88J)
C203  value 100nF  [CAPC100X50X55L25N]  (hidden comment: GRM155R71C104KA88J)
R23  value 200  [RESC1608X55N]  (hidden comment: MCT06030C2000FP500)
R24  value 50  [RESC1005X40N]  (hidden comment: FC0402E50R0BST1)
R25  value 50  [RESC1005X40N]  (hidden comment: FC0402E50R0BST1)
R26  value 50  [RESC1005X40N]  (hidden comment: FC0402E50R0BST1)
R29  value 50  [RESC1005X40N]  (hidden comment: FC0402E50R0BST1)
R30  value 200  [RESC1608X55N]  (hidden comment: MCT06030C2000FP500)
TP17  MS-180(20)  [MS-180(20)]  (value not drawn)
TP27  MS-180(20)  [MS-180(20)]  (value not drawn)
U6  LMH6554LE  [NHJ0014A]

### Ports
IN (harness DIFF100), OUT (harness DIFF100), VCC (in)

### Harnesses
DIFF100: S_P, S_N

### Nets
GND: C90.1 C91.1 C92.1 C93.1 TP17.G(GND) TP27.G(GND) U6.3(V-) U6.8(V-) U6.11(NC) U6.14(NC)
VREF-CM-ADC: U6.2(VCM)
A3_N: R23.1 R24.2 U6.5(IN-)  [project net A3_N_20]
A3_P: R26.2 R30.1 U6.6(IN+)  [project net A3_P_20]
A4_N: R23.2 U6.4(FB+)  [project net A4_N_20]
A4_P: R30.2 U6.7(FB-)  [project net A4_P_20]
A6_N: C201.2 R24.1  [project net A6_N_20]
A6_P: C203.2 R26.1  [project net A6_P_20]
A8_N: C201.1 TP17.A(OUT)  [project net A8_N_20]
A8_P: C203.1 TP27.A(OUT)  [project net A8_P_20]
IN-B_N: TP17.C(IN) ; port IN.S_P
IN-B_P: TP27.C(IN) ; port IN.S_N
VCC: C90.2 C91.2 C92.2 C93.2 U6.1(V+) U6.9(VEN) U6.10(V+) ; port VCC
NetR25_1: R25.1 U6.13(O+)
NetR25_2: R25.2 ; port OUT.S_P
NetR29_1: R29.1 U6.12(O-)
NetR29_2: R29.2 ; port OUT.S_N

### Layout directives
net class short: A3_N, A3_P, A4_N, A4_P
differential pair; net class z100diff12; Name: 100-Ohm(D.E.); net class rf: A6_N_20, A6_P_20, A8_N_20, A8_P_20, IN-B_N, IN-B_P

### Notes on the sheet
- Vpp(in) = 0.5V(D.E.)
- Vp = 0.25V(D.E.)
- Vrms = 0.177V(D.E.)
- (near TP17) Pin = 0.3mW (-5dBm)
- Z = 100-Ohms(D.E.)
- Title
- Engineer
- Revision
- Drawn By
- Checked By
- Date
- Sheet
- of

### Library data of the parts
C90 C91 = CAP 0402: as C9-C14 on sheet clock; Voltage: 50V; Manufacturer P/N: CGA2B2NP01H102J050BA; Package: 0402; Tolerance: ±5%
C92 C93 = CAP 0402: as C1-C5 on sheet clock; Voltage: 50V; Manufacturer P/N: GRM155R71H103KA88; Package: 0402; Tolerance: ±10%
C201 C203 = CAP 0402: as C6-C8 on sheet clock; Voltage: 16V; Manufacturer P/N: GRM155R71C104KA88J; Package: 0402; Tolerance: ±10%
R23 R30 = RES 0603: Thin Film Resistor 200 Ohm ±1% 0603; Manufacturer: Vishay; Tr: -55:155; Package: 0603; Manufacturer P/N: MCT06030C2000FP500; Do Not Place: *; Tolerance: ±1%
R24-R26 R29 = RES 0603: Thin Film RF Resistor 50 Ohm ±0.1% 0402; Manufacturer: Vishay; Tr: -55:155; Package: 0402; Manufacturer P/N: FC0402E50R0BST1; Do Not Place: *; Tolerance: ±0.1%
TP17 TP27 = MS-180(20): Coaxial Connector Switch; Manufacturer: Hirose; Manufacturer P/N: MS-180(20)
U6 = LMH6554LE: 2.8 GHz Ultra Linear Fully Differential Amplifier; Manufacturer: Texas Instruments; Manufacturer P/N: LMH6554LE

## Nets that join several sheets
GND: con-left-bot (174 pins), con-right-bot (174 pins), eth (49 pins), eth-ldo (10 pins), dsa (26 pins), ifamp-tx (22 pins), amp-33dbm (18 pins), ifamp-rx (23 pins), dac-digital (14 pins), dac-analog (12 pins), dac-power (31 pins), dac-misc (61 pins), dac-ldo (24 pins), adc (8 pins), adc-digital (R107.1), adc-power (31 pins), adc-analog (7 pins), adc-ldo (24 pins), fans (6 pins), clock (75 pins), ingress (8 pins), adc-amp (10 pins)
V1V2-A-DAC: dac-power (C282.1 C283.1 L16.1 L19.1), dac-ldo (6 pins)
V1V2-D-DAC: dac-power (13 pins), dac-ldo (6 pins)
V1V8: con-right-bot (22 pins), adc-digital (R104.2)
V1V8-A-ADC: adc-power (C229.1 C230.1 C231.1 L9.1), adc-ldo (6 pins)
V1V8-D-ADC: adc-power (L7.1), adc-ldo (6 pins)
V1V8-D-ADC-FILT: adc (U8.15), adc-power (11 pins)
V2V5: con-left-bot (22 pins), eth (10 pins), dac-digital (12 pins)
V3: adc (8 pins), fans (MB1.1)
V3V3-ADC: adc-power (C221.1 C222.1 C223.1 L8.1), adc-ldo (6 pins)
V3V3-DAC: dac-power (21 pins), dac-ldo (6 pins)
V3V3-ETH: eth (9 pins), eth-ldo (6 pins)
V3V8: eth-ldo (C420.2 U43.15 U43.16), dac-ldo (11 pins), adc (U9.B2), adc-ldo (9 pins)
V5V5: fans (F6.1 F7.1 F8.1 F9.1), ingress (C43.1 P3.1 P3.2)
V48: con-right-bot (16 pins), ingress (P1.8)
VREF-CM-ADC: adc-analog (8 pins), adc-amp (U6.2)
NetU8_11: adc (U8.11), adc-digital (U21.22)
NetU8_12: adc (U8.12), adc-digital (U21.20)
NetU8_13: adc (U8.13), adc-digital (U21.19)
NetU8_14: adc (U8.14), adc-digital (U21.18)